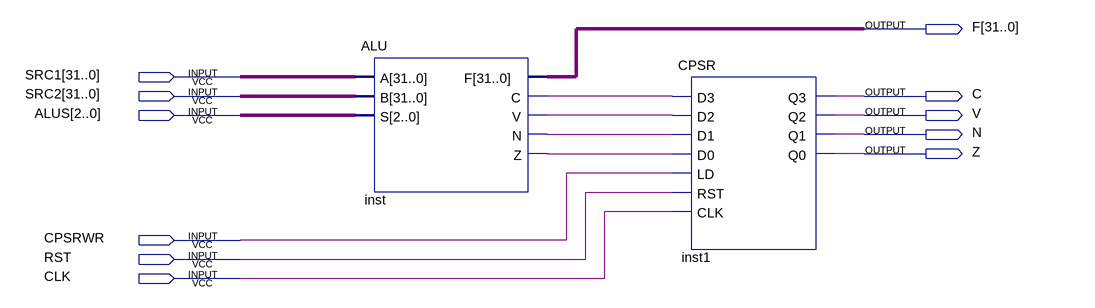
[diagram p0: schematic sheet]
// Quartus schematic execute.bdf as structural Verilog: 2 symbols, 11 pins
module execute (
  input  [31:0] SRC1,
  input  [31:0] SRC2,
  input  [2:0] ALUS,
  input  CPSRWR,
  input  RST,
  input  CLK,
  output [31:0] F,
  output C,
  output V,
  output N,
  output Z
);

  wire inst_c, inst_n, inst_v, inst_z;

  ALU inst (.A(SRC1), .B(SRC2), .S(ALUS), .F(F), .C(inst_c), .V(inst_v), .N(inst_n), .Z(inst_z));
  CPSR inst1 (
    .D3(inst_c), .D2(inst_v), .D1(inst_n), .D0(inst_z), .LD(CPSRWR), .RST(RST), .CLK(CLK), .Q3(C), .Q2(V),
    .Q1(N), .Q0(Z));
endmodule
